# Altium project MCU_STM32.PrjPcb
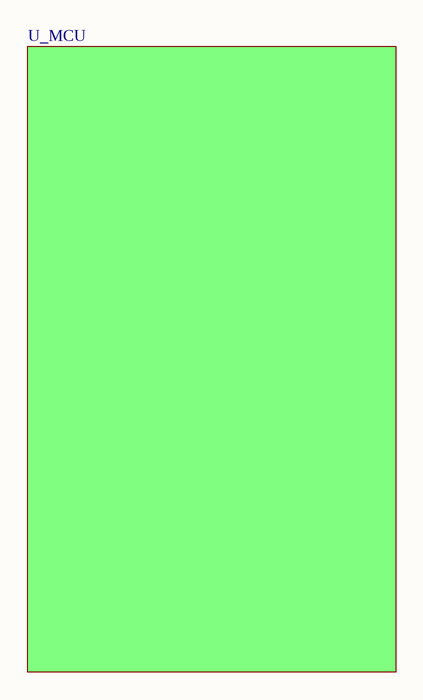
[diagram p0: TOP.SchDoc]
2 sheets, 1 parts. Net scope: global (net labels, ports and power ports of the same name join across sheets).
Board file: MCU_STM32.PcbDoc
Sheets:
  TOP.SchDoc
    U_MCU = MCU.SchDoc

## Sheet TOP.SchDoc
size A3; SheetNumber: 1; SheetTotal: 2

### Sub-sheets
U_MCU = MCU.SchDoc: no entries

## Sheet MCU.SchDoc
size A4; SheetNumber: 2; SheetTotal: 2
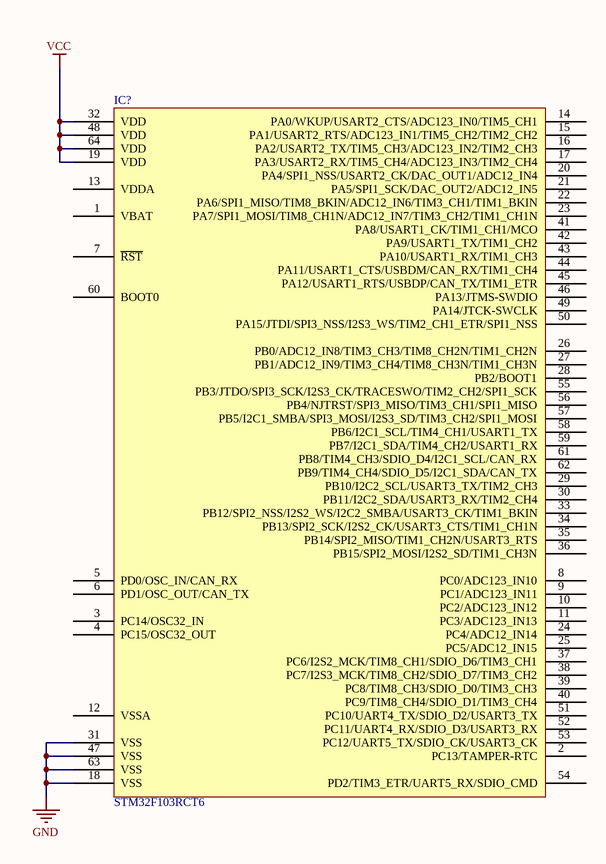
[diagram p1: MCU.SchDoc]

### Parts
IC?  STM32F103RCT6  [ST LQFP-64 10X10MM]

### Nets
GND: IC?.18(VSS) IC?.31(VSS) IC?.47(VSS) IC?.63(VSS)
VCC: IC?.19(VDD) IC?.32(VDD) IC?.48(VDD) IC?.64(VDD)

Not connected (* = marked no-connect by the designer): IC? 1(VBAT) 2(PC13/TAMPER-RTC) 3(PC14/OSC32_IN) 4(PC15/OSC32_OUT) 5(PD0/OSC_IN/CAN_RX) 6(PD1/OSC_OUT/CAN_TX) 7(~{RST}) 8(PC0/ADC123_IN10) 9(PC1/ADC123_IN11) 10(PC2/ADC123_IN12) 11(PC3/ADC123_IN13) 12(VSSA) 13(VDDA) 14(PA0/WKUP/USART2_CTS/ADC123_IN0/TIM5_CH1) 15(PA1/USART2_RTS/ADC123_IN1/TIM5_CH2/TIM2_CH2) 16(PA2/USART2_TX/TIM5_CH3/ADC123_IN2/TIM2_CH3) 17(PA3/USART2_RX/TIM5_CH4/ADC123_IN3/TIM2_CH4) 20(PA4/SPI1_NSS/USART2_CK/DAC_OUT1/ADC12_IN4) 21(PA5/SPI1_SCK/DAC_OUT2/ADC12_IN5) 22(PA6/SPI1_MISO/TIM8_BKIN/ADC12_IN6/TIM3_CH1/TIM1_BKIN) 23(PA7/SPI1_MOSI/TIM8_CH1N/ADC12_IN7/TIM3_CH2/TIM1_CH1N) 24(PC4/ADC12_IN14) 25(PC5/ADC12_IN15) 26(PB0/ADC12_IN8/TIM3_CH3/TIM8_CH2N/TIM1_CH2N) 27(PB1/ADC12_IN9/TIM3_CH4/TIM8_CH3N/TIM1_CH3N) 28(PB2/BOOT1) 29(PB10/I2C2_SCL/USART3_TX/TIM2_CH3) 30(PB11/I2C2_SDA/USART3_RX/TIM2_CH4) 33(PB12/SPI2_NSS/I2S2_WS/I2C2_SMBA/USART3_CK/TIM1_BKIN) 34(PB13/SPI2_SCK/I2S2_CK/USART3_CTS/TIM1_CH1N) 35(PB14/SPI2_MISO/TIM1_CH2N/USART3_RTS) 36(PB15/SPI2_MOSI/I2S2_SD/TIM1_CH3N) 37(PC6/I2S2_MCK/TIM8_CH1/SDIO_D6/TIM3_CH1) 38(PC7/I2S3_MCK/TIM8_CH2/SDIO_D7/TIM3_CH2) 39(PC8/TIM8_CH3/SDIO_D0/TIM3_CH3) 40(PC9/TIM8_CH4/SDIO_D1/TIM3_CH4) 41(PA8/USART1_CK/TIM1_CH1/MCO) 42(PA9/USART1_TX/TIM1_CH2) 43(PA10/USART1_RX/TIM1_CH3) 44(PA11/USART1_CTS/USBDM/CAN_RX/TIM1_CH4) 45(PA12/USART1_RTS/USBDP/CAN_TX/TIM1_ETR) 46(PA13/JTMS-SWDIO) 49(PA14/JTCK-SWCLK) 50(PA15/JTDI/SPI3_NSS/I2S3_WS/TIM2_CH1_ETR/SPI1_NSS) 51(PC10/UART4_TX/SDIO_D2/USART3_TX) 52(PC11/UART4_RX/SDIO_D3/USART3_RX) 53(PC12/UART5_TX/SDIO_CK/USART3_CK) 54(PD2/TIM3_ETR/UART5_RX/SDIO_CMD) 55(PB3/JTDO/SPI3_SCK/I2S3_CK/TRACESWO/TIM2_CH2/SPI1_SCK) 56(PB4/NJTRST/SPI3_MISO/TIM3_CH1/SPI1_MISO) 57(PB5/I2C1_SMBA/SPI3_MOSI/I2S3_SD/TIM3_CH2/SPI1_MOSI) 58(PB6/I2C1_SCL/TIM4_CH1/USART1_TX) 59(PB7/I2C1_SDA/TIM4_CH2/USART1_RX) 60(BOOT0) 61(PB8/TIM4_CH3/SDIO_D4/I2C1_SCL/CAN_RX) 62(PB9/TIM4_CH4/SDIO_D5/I2C1_SDA/CAN_TX)

### Library data of the parts
IC? = STM32F103RCT6: IC MCU 32BIT 256KB FLASH 64LQFP; Manufacturer: STMicroelectronics; Connectivity: CANbus, I²C, IrDA, LINbus, SPI, UART/USART, USB; Core Processor: ARM® Cortex®-M3; Core Size: 32-Bit; Data Converters: A/D 16x12b; D/A 2x12b; Number of I/O: 51; Oscillator Type: Internal; Peripherals: DMA, Motor Control PWM, PDR, POR, PVD, PWM, Temp Sensor, WDT; Program Memory Size: 256KB (256K x 8); RAM Size: 48K x 8; Speed: 72MHz; Voltage - Supply (Vcc/Vdd): 2V ~ 3.6V; Part Number: STM32F103RCT6; ComponentLink1Description: Datasheet; ComponentLink1URL: http://www.st.com/content/ccc/resource/technical/document/datasheet/59/f6/fa/84/20/4e/4c/59/CD00191185.pdf/files/CD00191185.pdf/jcr:content/translations/en.CD00191185.pdf; ComponentLink2Description: DigiKey Link; ComponentLink2URL: //digikey.com/product-detail/en/stmicroelectronics/STM32F103RCT6/497-9033-ND/2035353; Device Package: 64-LQFP; LastUpdated: 2019/12/4 4:24:43; Lifecycle Status: 0; Minimum Order: 1; Mounting Type: Surface Mount; Operating Temperature: -40°C ~ 85°C (TA); Package / Case: 64-LQFP; Packaging: Tray; PartId: 97; Part Status: Active; Price: 6.54; Program Memory Type: FLASH; Series: STM32F1; Supplier 1: DigiKey; Supplier Part Number 1: 497-9033-ND